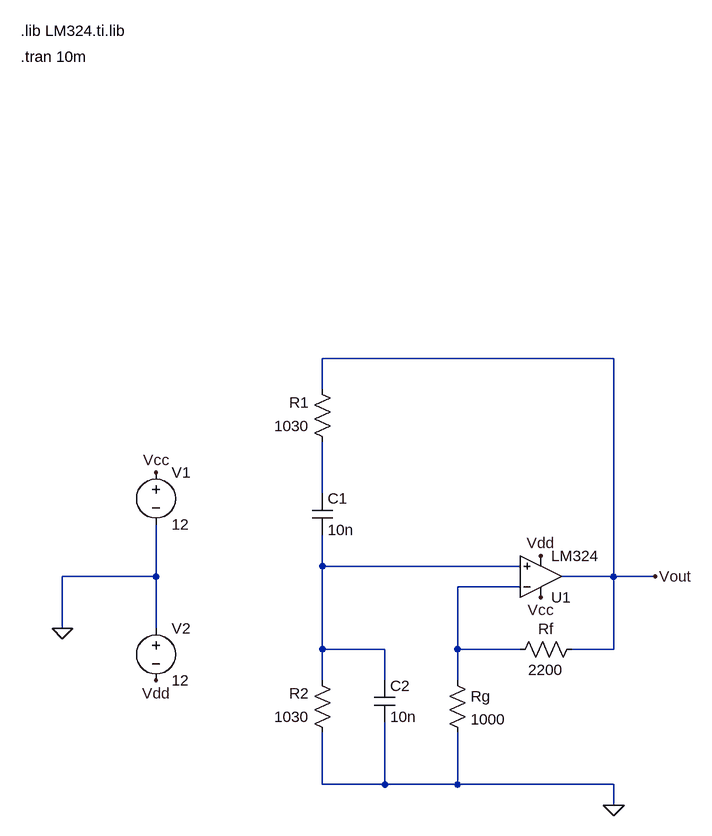
[diagram p0: schematic Osc_Wien.asc]
Osc_Wien.asc, the LTspice schematic file:
Version 4
SHEET 1 880 852
WIRE 736 144 288 144
WIRE 288 192 288 144
WIRE 288 352 288 272
WIRE 288 464 288 416
WIRE 592 464 288 464
WIRE 32 480 32 400
WIRE 32 480 -112 480
WIRE 736 480 736 144
WIRE 736 480 656 480
WIRE 800 480 736 480
WIRE 592 496 496 496
WIRE -112 560 -112 480
WIRE 32 560 32 480
WIRE 288 592 288 464
WIRE 384 592 288 592
WIRE 496 592 496 496
WIRE 592 592 496 592
WIRE 736 592 736 480
WIRE 736 592 672 592
WIRE 288 640 288 592
WIRE 384 640 384 592
WIRE 496 640 496 592
WIRE 288 800 288 720
WIRE 384 800 384 704
WIRE 384 800 288 800
WIRE 496 800 496 720
WIRE 496 800 384 800
WIRE 736 800 496 800
WIRE 736 832 736 800
FLAG 736 832 0
FLAG 624 512 Vcc
FLAG 624 448 Vdd
FLAG 800 480 Vout
FLAG -112 560 0
FLAG 32 320 Vcc
FLAG 32 640 Vdd
SYMBOL OpAmps\\opamp2 624 544 M180
SYMATTR InstName U1
SYMATTR Value LM324
SYMBOL res 480 624 R0
SYMATTR InstName Rg
SYMATTR Value 1000
SYMBOL res 688 576 R90
WINDOW 0 0 56 VBottom 2
WINDOW 3 32 56 VTop 2
SYMATTR InstName Rf
SYMATTR Value 2200
SYMBOL res 304 288 R180
WINDOW 0 36 76 Left 2
WINDOW 3 36 40 Left 2
SYMATTR InstName R1
SYMATTR Value 1030
SYMBOL res 304 736 R180
WINDOW 0 36 76 Left 2
WINDOW 3 36 40 Left 2
SYMATTR InstName R2
SYMATTR Value 1030
SYMBOL cap 272 352 R0
SYMATTR InstName C1
SYMATTR Value 10n
SYMBOL cap 368 640 R0
SYMATTR InstName C2
SYMATTR Value 10n
SYMBOL voltage 32 304 R0
WINDOW 123 0 0 Left 0
WINDOW 39 0 0 Left 0
SYMATTR InstName V1
SYMATTR Value 12
SYMBOL voltage 32 544 R0
WINDOW 123 0 0 Left 0
WINDOW 39 0 0 Left 0
SYMATTR InstName V2
SYMATTR Value 12
TEXT -176 -360 Left 2 !.lib LM324.ti.lib
TEXT -176 -320 Left 2 !.tran 10m

The netlist it stands for:
* Osc_Wien.asc
XU1 N002 N003 Vcc Vdd Vout LM324  ; pins In+ In- V+ V- OUT
Rg N003 0 1000
Rf Vout N003 2200
R1 N001 Vout 1030
R2 0 N002 1030
C1 N001 N002 10n
C2 N002 0 10n
V1 Vcc 0 12
V2 0 Vdd 12
.lib LM324.ti.lib
.tran 10m
.backanno
.end